# EAGLE design final_proj_board (EAGLE 7.4.0)
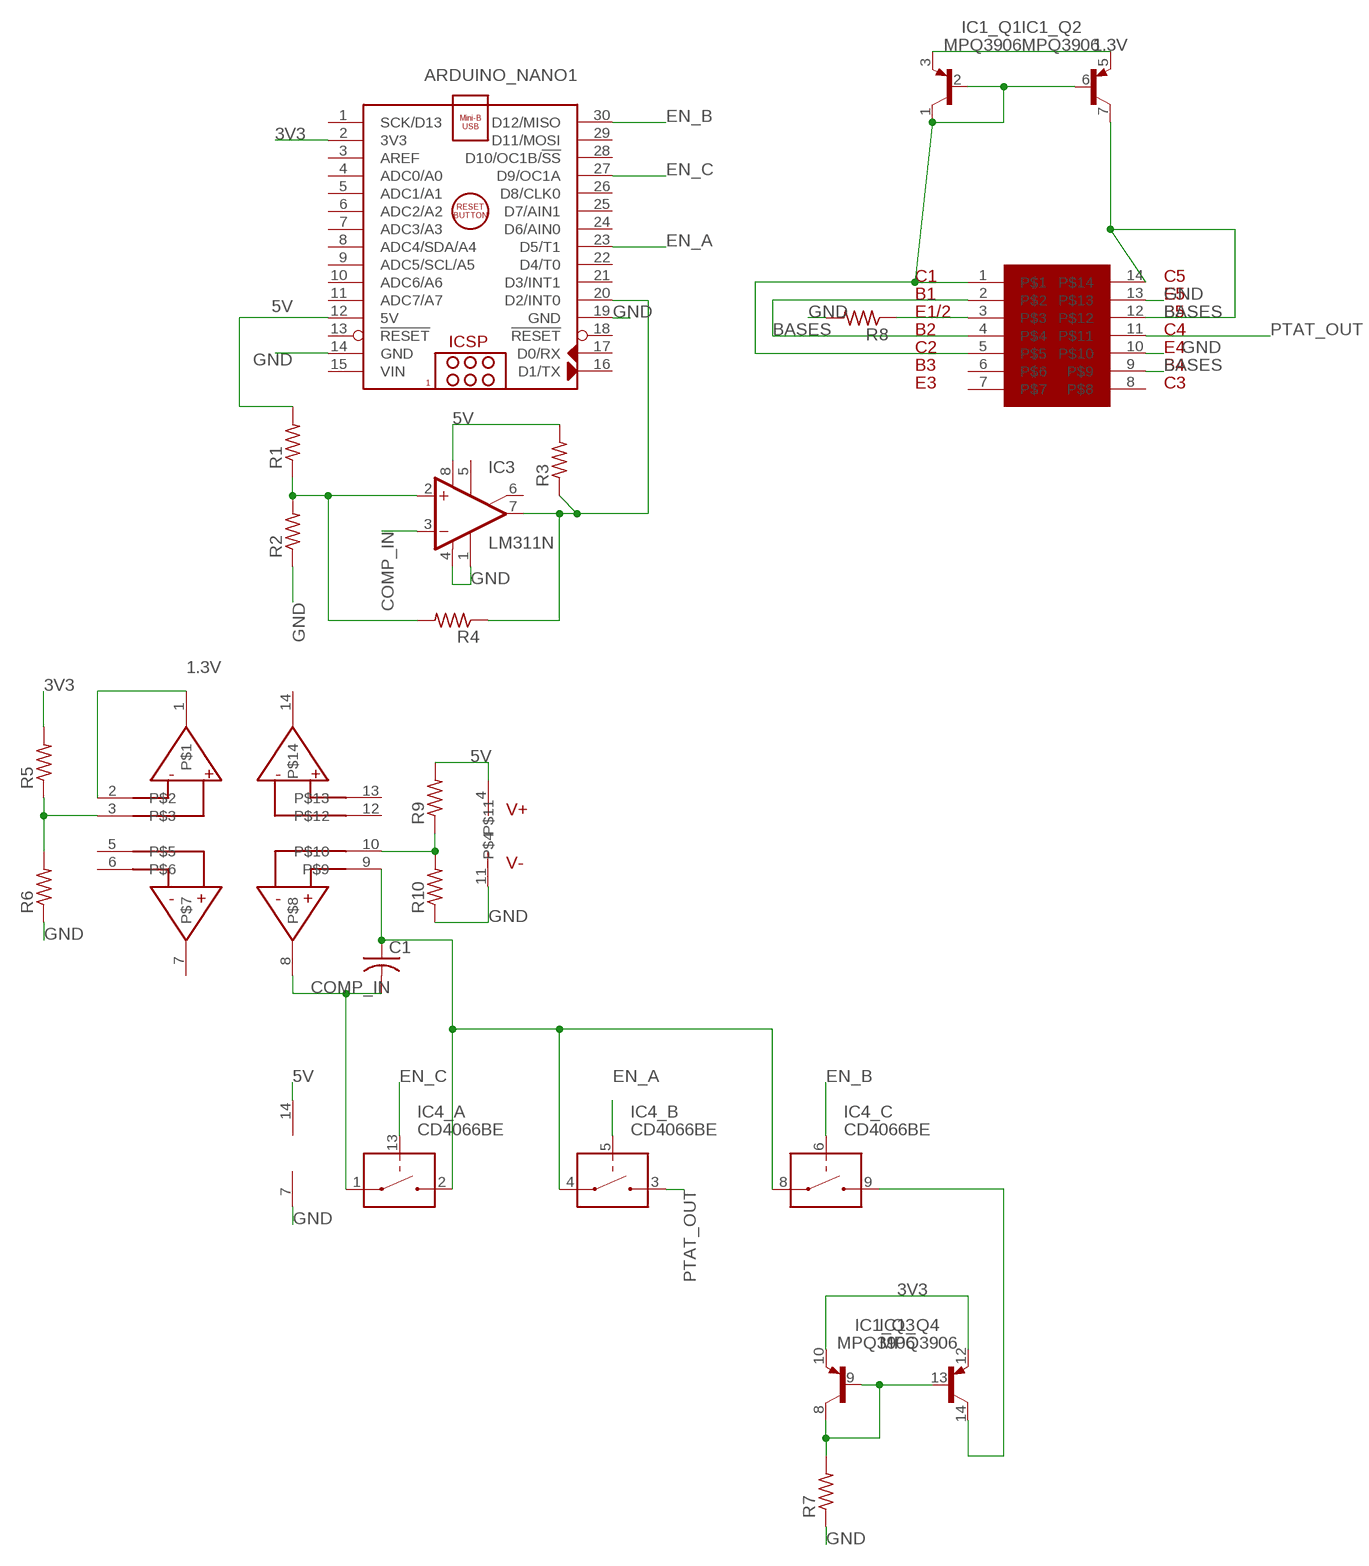
[diagram p0: schematic, sheet 1]

## Parts
ARDUINO_NANO1  ARDUINO_NANO  [ARDUINO_NANO]
C1  C-US050-024X044  [C050-024X044]
IC1  MPQ3906  [DIL14]
IC2  CA3046  [DIL14]
IC3  LM311N  [DIL08]
IC4  CD4066BE  [DIL14]
R1  R-US_0204/7  [0204/7]
R2  R-US_0204/7  [0204/7]
R3  R-US_0204/7  [0204/7]
R4  R-US_0204/7  [0204/7]
R5  R-US_0204/7  [0204/7]
R6  R-US_0204/7  [0204/7]
R7  R-US_0204/7  [0204/7]
R8  R-US_0204/7  [0204/7]
R9  R-US_0204/7  [0204/7]
R10  R-US_0204/7  [0204/7]
U$1  LM6134  [DIL14]

## Nets
1.3V: IC1.3(_Q1:E) IC1.5(_Q2:E) U$1.1 U$1.2
3V3: ARDUINO_NANO1.2(3V3) IC1.10(_Q3:E) IC1.12(_Q4:E) R5.2
5V: ARDUINO_NANO1.12(5V) IC3.8(V+) IC4.14(V+) R1.2 R3.2 R9.2 U$1.4
BASES: IC1.7(_Q2:C) IC2.2 IC2.4 IC2.9 IC2.12 IC2.14
COMP_IN: C1.2 IC3.3(-IN) IC4.1(_A:IN/OUT1) U$1.8
EN_A: ARDUINO_NANO1.23(D5/T1) IC4.5(_B:CONTROL)
EN_B: ARDUINO_NANO1.30(D12/MISO) IC4.6(_C:CONTROL)
EN_C: ARDUINO_NANO1.27(D9/OC1A) IC4.13(_A:CONTROL)
GND: ARDUINO_NANO1.14(GND) ARDUINO_NANO1.19(GND) IC2.10 IC2.13 IC3.1(GND) IC3.4(V-) IC4.7(V-) R2.1 R6.1 R7.1 R8.2 R10.1 U$1.11
N$1: IC2.3 R8.1
N$2: IC1.1(_Q1:C) IC1.2(_Q1:B) IC1.6(_Q2:B) IC2.1 IC2.5
N$4: ARDUINO_NANO1.20(D2/INT0) IC3.7(OUT) R3.1 R4.1
N$5: IC3.2(+IN) R1.1 R2.2 R4.2
N$7: R9.1 R10.2 U$1.10
N$8: C1.1 IC4.2(_A:IN/OUT2) IC4.4(_B:IN/OUT1) IC4.8(_C:IN/OUT1) U$1.9
N$9: IC1.8(_Q3:C) IC1.9(_Q3:B) IC1.13(_Q4:B) R7.2
N$10: R5.1 R6.2 U$1.3
N$12: IC1.14(_Q4:C) IC4.9(_C:IN/OUT2)
PTAT_OUT: IC2.11 IC4.3(_B:IN/OUT2)
Unconnected: ARDUINO_NANO1.1(SCK/D13) ARDUINO_NANO1.3(AREF) ARDUINO_NANO1.4(ADC0/A0) ARDUINO_NANO1.5(ADC1/A1) ARDUINO_NANO1.6(ADC2/A2) ARDUINO_NANO1.7(ADC3/A3) ARDUINO_NANO1.8(ADC4/SDA/A4) ARDUINO_NANO1.9(ADC5/SCL/A5) ARDUINO_NANO1.10(ADC6/A6) ARDUINO_NANO1.11(ADC7/A7) ARDUINO_NANO1.13(!RESET) ARDUINO_NANO1.16(D1/TX) ARDUINO_NANO1.17(D0/RX) ARDUINO_NANO1.18(!RESET) ARDUINO_NANO1.21(D3/INT1) ARDUINO_NANO1.22(D4/T0) ARDUINO_NANO1.24(D6/AIN0) ARDUINO_NANO1.25(D7/AIN1) ARDUINO_NANO1.26(D8/CLK0) ARDUINO_NANO1.28(D10/OC1B/!SS) ARDUINO_NANO1.29(D11/MOSI) IC2.6 IC2.7 IC2.8 IC3.5(ON) IC3.6(ON/STR) IC4.10(_D:IN/OUT2) IC4.11(_D:IN/OUT1) IC4.12(_D:CONTROL) U$1.5 U$1.6 U$1.7 U$1.12 U$1.13 U$1.14

## Power pins joined to a net without a drawn wire
VIN: ARDUINO_NANO1.15(VIN)

## Library data of the parts
ARDUINO_NANO1 = 6301-temp-sensor-rev1:ARDUINO_NANO: Arduino Nano V3.0 Module Overview: The Arduino Nano is a small, complete, and breadboard-friendly board based on the ATmega328 (Arduino Nano 3.x) or ATmega168 (Arduino Nano 2.x). It has more or less the same functionality of the Arduino Duemilanove, but in a different package. It lacks only a DC power jack, and works with a Mini-B USB cable instead of a standard one. The Nano was designed and is being produced by Gravitech <http://www.gravitech.us/arna30wiatp.html>. General specifications: Item Value Microcontroller Atmel ATmega168 or ATmega328 Operating Voltage (logic level) 5 V Input Voltage (recommended) 7-12 V Input Voltage (limits) 6-20 V Digital I/O Pins 14 (of which 6 provide PWM output) Analog Input Pins 8 DC Current per I/O Pin 40 mA Flash Memory 16 KB (ATmega168) or 32 KB (ATmega328) of which 2 KB used by bootloader SRAM 1 KB (ATmega168) or 2 KB (ATmega328) EEPROM 512 bytes (ATmega168) or 1 KB (ATmega328) Clock Speed 16 MHz Dimensions (Inches) 0.73" x 1.70" Dimensions (mm) 18mm x 45mm Overall height About 9 mm (not including pins) Weigth 5 g Power: The Arduino Nano can be powered via the Mini-B USB connection, 6-20V unregulated external power supply (pin 30), or 5V regulated external power supply (pin 27). The power source is automatically selected to the highest voltage source. Memory: The ATmega168 has 16 KB of flash memory for storing code (of which 2 KB is used for the bootloader); the ATmega328 has 32 KB, (also with 2 KB used for the bootloader). The ATmega168 has 1 KB of SRAM and 512 bytes of EEPROM (which can be read and written with the EEPROM library); the ATmega328 has 2 KB of SRAM and 1 KB of EEPROM. Input and Output: Each of the 14 digital pins on the Nano can be used as an input or output, using pinMode(), digitalWrite(), and digitalRead() functions. They operate at 5 volts. Each pin can provide or receive a maximum of 40 mA and has an internal pull-up resistor (disconnected by default) of 20-50 kOhms. In addition, some pins have specialized functions. Visit Arduino - ArduinoBoardNano <https://www.arduino.cc/en/Main/ArduinoBoardNano>
C1 = resistor:C-US: CAPACITOR, American symbol
IC1 = 6301-temp-sensor-rev1:MPQ3906
IC2 = 6301-temp-sensor-rev1:CA3046
IC3 = 6301-temp-sensor-rev1:LM311: COMPARATOR
IC4 = 6301-temp-sensor-rev1:CD4066BE
R1-R10 = rcl:R-US_: RESISTOR, American symbol
U$1 = LM6134:LM6134

## Board
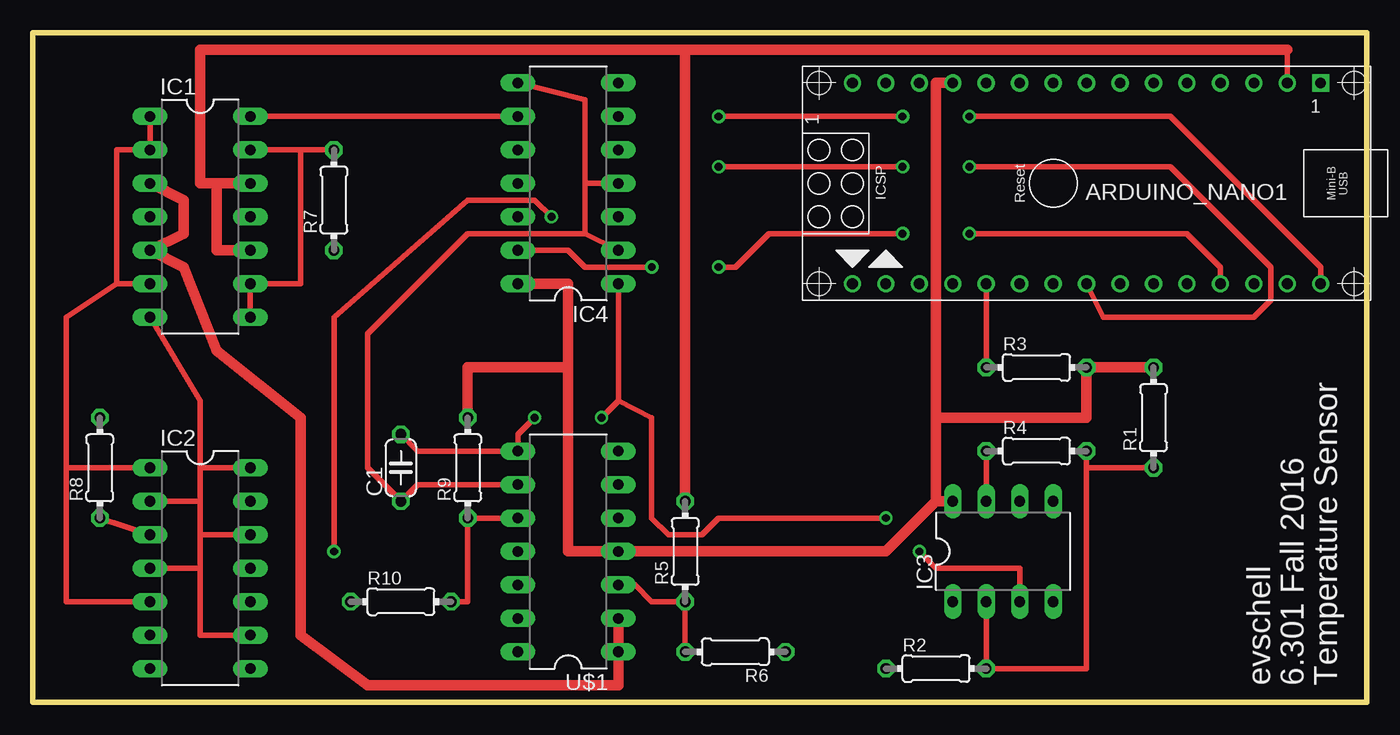
[diagram p1: board, top side]
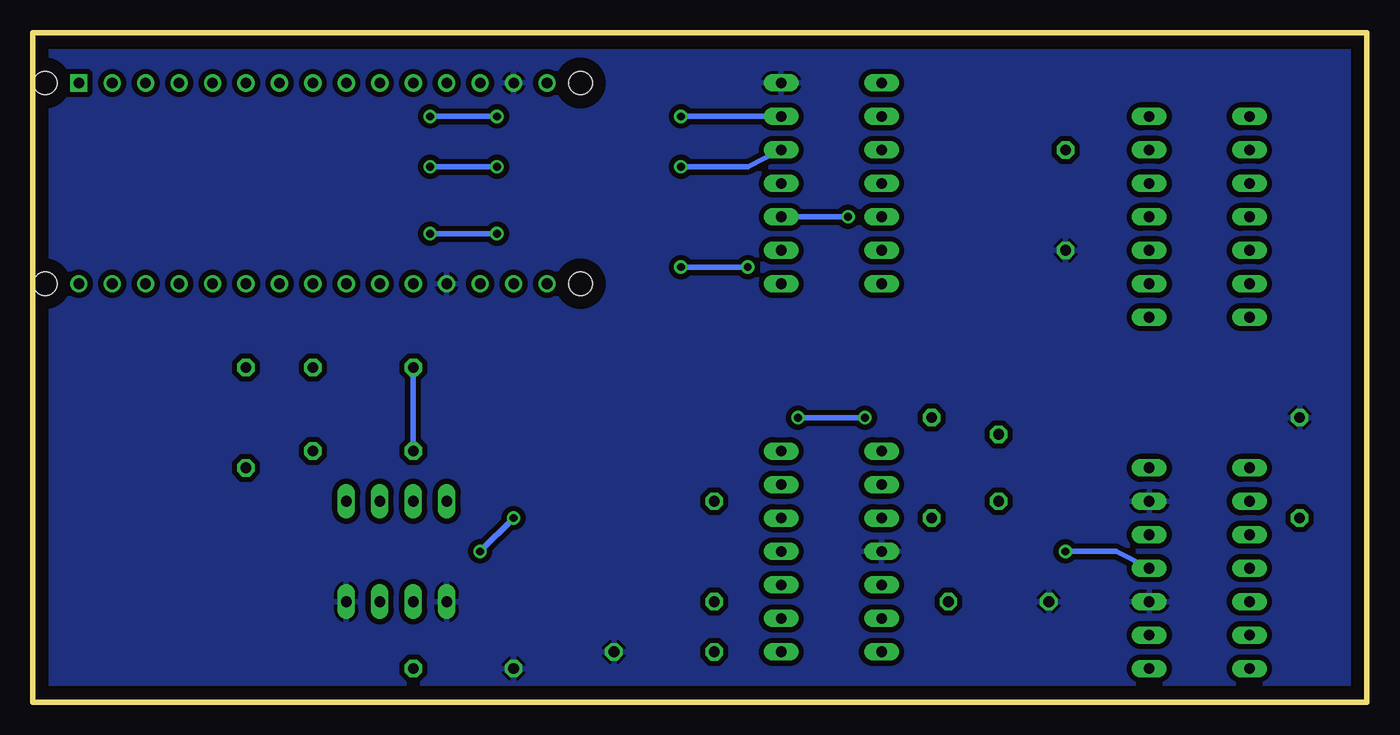
[diagram p2: board, bottom side, seen from below]

Size 101.27 x 50.79 mm. Coordinates in mm from the lower left corner, seen from the top.
Outline: 0,0 101.27,0 101.27,50.79 0,50.79 0,0
Copper layers (1*16): Top 0.035mm / dielectric 1.5mm / Bottom 0.035mm
Design rules "default": minimum track width 10mil, minimum drill 24mil, track to track 8mil, track to pad 8mil, pad to pad 8mil, via to via 8mil, smd to smd 8mil, copper to edge 40mil, drill to drill 8mil, minimum pad ring 10mil, minimum via ring 8mil, stop-mask expansion 4mil, vias tented up to drill 0mil, thermal gap 10mil

### Footprints (pad centres in the part's own frame; a part is rotated, then mirrored left to right if it is on the bottom)
ARDUINO_NANO = drill 0.8 square: 1 -20.32,-7.62 | drill 0.8: 2 -17.78,-7.62; 3 -15.24,-7.62; 4 -12.7,-7.62; 5 -10.16,-7.62; 6 -7.62,-7.62; 7 -5.08,-7.62; 8 -2.54,-7.62; 9 0,-7.62; 10 2.54,-7.62; 11 5.08,-7.62; 12 7.62,-7.62; 13 10.16,-7.62; 14 12.7,-7.62; 15 15.24,-7.62; 16 15.24,7.62; 17 12.7,7.62; 18 10.16,7.62; 19 7.62,7.62; 20 5.08,7.62; 21 2.54,7.62; 22 0,7.62; 23 -2.54,7.62; 24 -5.08,7.62; 25 -7.62,7.62; 26 -10.16,7.62; 27 -12.7,7.62; 28 -15.24,7.62; 29 -17.78,7.62; 30 -20.32,7.62 | hole 1.778: -22.86,-7.62; -22.86,7.62; 17.78,7.62; 17.78,-7.62
C050-024X044 = drill 0.813 octagon: 1 -2.54,0; 2 2.54,0
DIL14 = drill 0.813 long: 1 -7.62,-3.81; 2 -5.08,-3.81; 3 -2.54,-3.81; 4 0,-3.81; 5 2.54,-3.81; 6 5.08,-3.81; 7 7.62,-3.81; 8 7.62,3.81; 9 5.08,3.81; 10 2.54,3.81; 11 0,3.81; 12 -2.54,3.81; 13 -5.08,3.81; 14 -7.62,3.81
DIL08 = drill 0.813 long: 1 -3.81,-3.81; 2 -1.27,-3.81; 3 1.27,-3.81; 4 3.81,-3.81; 5 3.81,3.81; 6 1.27,3.81; 7 -1.27,3.81; 8 -3.81,3.81
0204/7 = drill 0.813 octagon: 1 -3.81,0; 2 3.81,0

### Placement (x,y rotation side)
ARDUINO_NANO1  77.47,39.37 180 top
C1  27.94,17.78 90 top
IC1  12.7,36.83 270 top
IC2  12.7,10.16 270 top
IC3  73.66,11.43 0 top
IC4  40.64,39.37 90 top
R1  85.09,21.59 90 top
R2  68.58,2.54 0 top
R3  76.2,25.4 0 top
R4  76.2,19.05 0 top
R5  49.53,11.43 90 top
R6  53.34,3.81 180 top
R7  22.86,38.1 90 top
R8  5.08,17.78 90 top
R9  33.02,17.78 90 top
R10  27.94,7.62 0 top
U$1  40.64,11.43 90 top

### Tracks (layer width: path | path; a pad name or v marks a point on that pad's centre or on a via)
1.3V
  Top 0.813: IC1.3 11.43,38.1 11.43,35.56 IC1.5 11.43,33.02 13.97,26.67 20.32,21.59 20.32,5.08 25.4,1.27 44.45,1.27 U$1.1 U$1.2
3V3
  Top 0.406: ARDUINO_NANO1.2 95.25,49.53
  Top 0.813: 95.25,49.53 49.53,49.53 | 49.53,49.53 12.7,49.53 12.7,39.37 13.97,39.37 | 13.97,39.37 IC1.12 | IC1.10 13.97,34.29 13.97,39.37 | R5.2 49.53,49.53
5V
  Top 0.813: ARDUINO_NANO1.12 68.58,46.99 68.58,21.59 | 68.58,21.59 68.58,15.24 | 68.58,15.24 IC3.8 | 68.58,15.24 64.77,11.43 U$1.4 40.64,11.43 40.64,25.4 | R1.2 R3.2 80.01,21.59 68.58,21.59 | IC4.14 40.64,31.75 40.64,25.4 | R9.2 33.02,25.4 40.64,25.4
BASES
  Top 0.406: IC2.9 12.7,5.08 12.7,10.16 | 12.7,10.16 12.7,12.7 | 12.7,12.7 12.7,15.24 | 12.7,15.24 12.7,17.78 | 12.7,17.78 12.7,22.86 IC1.7 | IC2.14 12.7,17.78 | IC2.12 12.7,12.7 | IC2.4 12.7,10.16 | IC2.2 12.7,15.24
COMP_IN  (via drill 0.6)
  Top 0.406: IC3.3 74.93,10.16 68.58,10.16 v67.31,11.43 | C1.2 29.21,19.05 U$1.8 36.83,20.32 v38.1,21.59 | IC4.1 44.45,22.86 | 44.45,22.86 v43.18,21.59 | v64.77,13.97 52.07,13.97 50.8,12.7 48.26,12.7 46.99,13.97 46.99,21.59 44.45,22.86
  Bottom 0.406: v67.31,11.43 v64.77,13.97 | v43.18,21.59 v38.1,21.59
EN_A  (via drill 0.6)
  Top 0.406: ARDUINO_NANO1.23 81.28,29.21 92.71,29.21 93.98,30.48 93.98,33.02 86.36,40.64 v71.12,40.64 | v66.04,40.64 v52.07,40.64
  Bottom 0.406: v71.12,40.64 v66.04,40.64 | v52.07,40.64 46.99,40.64 IC4.5
EN_B  (via drill 0.6)
  Top 0.406: ARDUINO_NANO1.30 97.79,33.02 86.36,44.45 v71.12,44.45 | v66.04,44.45 v52.07,44.45
  Bottom 0.406: v71.12,44.45 v66.04,44.45 | v52.07,44.45 IC4.6
EN_C  (via drill 0.6)
  Top 0.406: ARDUINO_NANO1.27 90.17,33.02 87.63,35.56 v71.12,35.56 | v66.04,35.56 55.88,35.56 53.34,33.02 v52.07,33.02 | v46.99,33.02 41.91,33.02 40.64,34.29 IC4.13
  Bottom 0.406: v71.12,35.56 v66.04,35.56 | v52.07,33.02 v46.99,33.02
GND
  pour Bottom (isolate 0.406): 0,50.8 0,0 101.6,0 101.6,50.8
N$1
  Top 0.406: IC2.3 R8.1
N$2
  Top 0.406: 6.35,7.62 IC2.5 2.54,7.62 2.54,17.78 | IC1.6 6.35,31.75 | 6.35,31.75 6.35,41.91 IC1.2 IC1.1 | 6.35,17.78 IC2.1 2.54,17.78 | 2.54,17.78 2.54,29.21 6.35,31.75
N$4
  Top 0.406: IC3.7 R4.1 | R3.1 ARDUINO_NANO1.20
  Bottom 0.406: R4.1 R3.1
N$5
  Top 0.406: R1.1 80.01,17.78 | 80.01,17.78 R4.2 | 80.01,17.78 80.01,2.54 R2.2 IC3.2
N$7
  Top 0.406: U$1.10 R9.1 33.02,7.62 R10.2
N$8
  Top 0.406: IC4.2 41.91,35.56 | 41.91,35.56 33.02,35.56 25.4,27.94 25.4,17.78 C1.1 29.21,16.51 U$1.9 | 41.91,35.56 41.91,39.37 | 41.91,39.37 IC4.4 | 41.91,39.37 41.91,45.72 IC4.8
N$9
  Top 0.406: R7.2 20.32,41.91 | 20.32,41.91 IC1.13 | IC1.8 IC1.9 20.32,31.75 20.32,41.91
N$10
  Top 0.406: R6.2 R5.1 46.99,7.62 45.72,8.89 U$1.3
N$12
  Top 0.406: IC4.9 IC1.14
PTAT_OUT  (via drill 0.6)
  Top 0.406: v39.37,36.83 38.1,38.1 33.02,38.1 22.86,29.21 v22.86,11.43
  Bottom 0.406: IC4.3 v39.37,36.83 | v22.86,11.43 19.05,11.43 IC2.11

### Text on the board
tNames: evschell | 6.301 Fall 2016 | Temperature Sensor